# EAGLE design enc_ma710 (EAGLE 9.6.2)
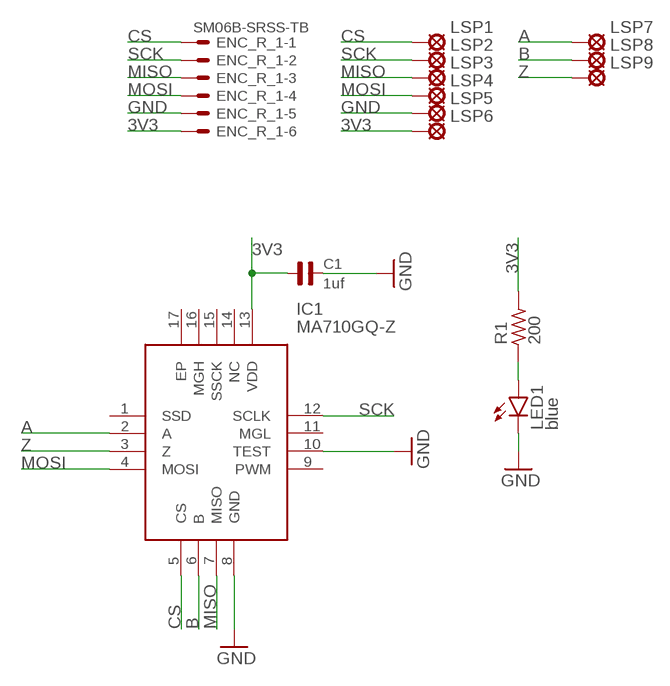
[diagram p0: schematic, sheet 1]

## Parts
C1  1uf  C0603  [0603]
ENC_R_1  SM06B-SRSS-TB  [SM06B-SRSS-TB]
IC1  MA710GQ-Z  [QFN50P300X300X100-17N]
LED1  blue  LEDSML0603  [SML0603]
LSP1  LSP10  [LSP10]
LSP2  LSP10  [LSP10]
LSP3  LSP10  [LSP10]
LSP4  LSP10  [LSP10]
LSP5  LSP10  [LSP10]
LSP6  LSP10  [LSP10]
LSP7  LSP10  [LSP10]
LSP8  LSP10  [LSP10]
LSP9  LSP10  [LSP10]
R1  200  R_0603  [R0603]

## Nets
3V3: C1.1 ENC_R_1.6 IC1.13(VDD) LSP6.MP R1.2
A: IC1.2(A) LSP7.MP
B: IC1.6(B) LSP8.MP
CS: ENC_R_1.1 IC1.5(CS) LSP1.MP
GND: C1.2 ENC_R_1.5 IC1.8(GND) IC1.10(TEST) LED1.C LSP5.MP
MISO: ENC_R_1.3 IC1.7(MISO) LSP3.MP
MOSI: ENC_R_1.4 IC1.4(MOSI) LSP4.MP
N$2: LED1.A R1.1
SCK: ENC_R_1.2 IC1.12(SCLK) LSP2.MP
Z: IC1.3(Z) LSP9.MP
Unconnected: IC1.1(SSD) IC1.9(PWM) IC1.11(MGL) IC1.14(NC) IC1.15(SSCK) IC1.16(MGH) IC1.17(EP)

## Library data of the parts
C1 = capsmd:C0603
ENC_R_1 = con-jst2:?M06B-SRSS-TB: Disconnectable Crimp style connector, 1.0mm pitch 6 contacts
IC1 = MA710GQ-Z:MA710GQ-Z: Board Mount Hall Effect / Magnetic Sensors 12-bit, digital, contactless angle sensor with ABZ incremental & PWM outputs Source: Datasheet <https://mouser.componentsearchengine.com/Datasheets/1/MA710GQ-Z.pdf>; DESCRIPTION: Board Mount Hall Effect / Magnetic Sensors 12-bit, digital, contactless angle sensor with ABZ incremental & PWM outputs; HEIGHT: 1mm; MANUFACTURER_NAME: Monolithic Power Systems (MPS); MANUFACTURER_PART_NUMBER: MA710GQ-Z; MOUSER_PART_NUMBER: 946-MA710GQ-Z; MOUSER_PRICE-STOCK: https://www.mouser.co.uk/ProductDetail/Monolithic-Power-Systems-MPS/MA710GQ-Z?qs=YCa%2FAAYMW008m2sVybM2dg%3D%3D
LED1 = led:LED: LED OSRAM: - CHIPLED LG R971, LG N971, LY N971, LG Q971, LY Q971, LO R971, LY R971 LH N974, LH R974 LS Q976, LO Q976, LY Q976 LO Q996 - Hyper CHIPLED LW Q18S LB Q993, LB Q99A, LB R99A - SideLED LS A670, LO A670, LY A670, LG A670, LP A670 LB A673, LV A673, LT A673, LW A673 LH A674 LY A675 LS A676, LA A676, LO A676, LY A676, LW A676 LS A679, LY A679, LG A679 - Hyper Micro SIDELED® LS Y876, LA Y876, LO Y876, LY Y876 LT Y87S - SmartLED LW L88C, LW L88S LB L89C, LB L89S, LG L890 LS L89K, LO L89K, LY L89K LS L896, LA L896, LO L896, LY L896 - TOPLED LS T670, LO T670, LY T670, LG T670, LP T670 LSG T670, LSP T670, LSY T670, LOP T670, LYG T670 LG T671, LOG T671, LSG T671 LB T673, LV T673, LT T673, LW T673 LH T674 LS T676, LA T676, LO T676, LY T676, LB T676, LH T676, LSB T676, LW T676 LB T67C, LV T67C, LT T67C, LS T67K, LO T67K, LY T67K, LW E67C LS E67B, LA E67B, LO E67B, LY E67B, LB E67C, LV E67C, LT E67C LW T67C LS T679, LY T679, LG T679 LS T770, LO T770, LY T770, LG T770, LP T770 LB T773, LV T773, LT T773, LW T773 LH T774 LS E675, LA E675, LY E675, LS T675 LS T776, LA T776, LO T776, LY T776, LB T776 LHGB T686 LT T68C, LB T68C - Hyper Mini TOPLED® LB M676 - Mini TOPLED Santana® LG M470 LS M47K, LO M47K, LY M47K Source: http://www.osram.convergy.de LUXEON: - LUMILED® LXK2-PW12-R00, LXK2-PW12-S00, LXK2-PW14-U00, LXK2-PW14-V00 LXK2-PM12-R00, LXK2-PM12-S00, LXK2-PM14-U00 LXK2-PE12-Q00, LXK2-PE12-R00, LXK2-PE12-S00, LXK2-PE14-T00, LXK2-PE14-U00 LXK2-PB12-K00, LXK2-PB12-L00, LXK2-PB12-M00, LXK2-PB14-N00, LXK2-PB14-P00, LXK2-PB14-Q00 LXK2-PR12-L00, LXK2-PR12-M00, LXK2-PR14-Q00, LXK2-PR14-R00 LXK2-PD12-Q00, LXK2-PD12-R00, LXK2-PD12-S00 LXK2-PH12-R00, LXK2-PH12-S00 LXK2-PL12-P00, LXK2-PL12-Q00, LXK2-PL12-R00 Source: www.luxeon.com KINGBRIGHT: KA-3528ASYC Source: www.kingbright.com
LSP1-LSP9 = solpad:LSP10: SOLDER PAD drill 1.0 mm, distributor Buerklin, 12H555
R1 = rc-master-smd:R_: RESISTOR

## Board
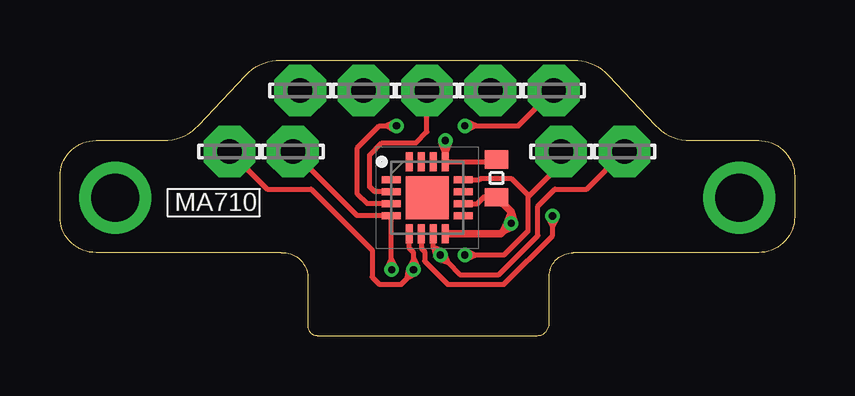
[diagram p1: board, top side]
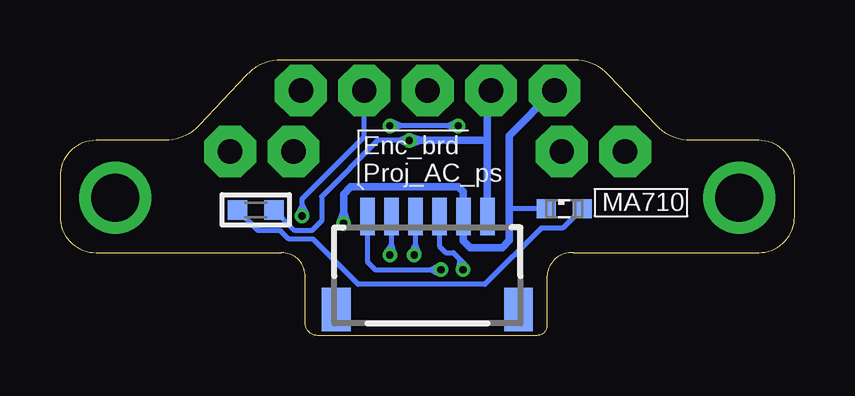
[diagram p2: board, bottom side, seen from below]

Size 30.61 x 11.48 mm. Coordinates in mm from the lower left corner, seen from the top.
Outline: 5.77,8.76 7.74,10.85 arc-47 9.2,11.48 21.38,11.48 arc-47 22.84,10.85 24.81,8.76 arc47 26.26,8.13 29.11,8.13 arc-90 30.61,6.63 30.61,4.95 arc-90 29.11,3.45 21.38,3.45 arc90 20.38,2.45 20.38,0.5 arc-90 19.88,0 10.72,0 arc-90 10.33,0.4 10.33,2.45 arc90 9.22,3.45 1.5,3.45 arc-90 0,4.95 0,6.63 arc-90 1.5,8.13 4.32,8.13 arc47 5.77,8.76
Copper layers (1*16): Top 0.035mm / dielectric 1.5mm / Bottom 0.035mm
Design rules "shuang_2layer_jlc_t1_compact": minimum track width 6mil, minimum drill 0.3mm, track to track 6mil, track to pad 6mil, pad to pad 6mil, via to via 6mil, smd to smd 6mil, copper to edge 5mil, drill to drill 6mil, minimum pad ring 6mil, minimum via ring 6mil, stop-mask expansion 4mil, vias tented up to drill 15mil, thermal gap 10mil

### Footprints (pad centres in the part's own frame; a part is rotated, then mirrored left to right if it is on the bottom)
0603 = smd 0.762 x 0.965: 1 -0.787,0; 2 0.787,0
SM06B-SRSS-TB = smd 0.6 x 1.55: 1 -2.5,2.975; 2 -1.5,2.975; 3 -0.5,2.975; 4 0.5,2.975; 5 1.5,2.975; 6 2.5,2.975 | smd 1.2 x 1.8: FIT@1 -3.8,-0.9; FIT@2 3.8,-0.9
QFN50P300X300X100-17N = smd 0.8 x 0.3: 1 -1.5,0.75; 2 -1.5,0.25; 3 -1.5,-0.25; 4 -1.5,-0.75; 9 1.5,-0.75; 10 1.5,-0.25; 11 1.5,0.25; 12 1.5,0.75 | smd 0.3 x 0.8: 5 -0.75,-1.5; 6 -0.25,-1.5; 7 0.25,-1.5; 8 0.75,-1.5; 13 0.75,1.5; 14 0.25,1.5; 15 -0.25,1.5; 16 -0.75,1.5 | smd 1.8 x 1.8: 17 0,0
SML0603 = smd 0.8 x 0.8: A 0.75,0; C -0.75,0
LSP10 = drill 1.016 pad 2.159 octagon: MP 0,0
R0603 = smd 0.8 x 0.8: 1 -0.762,0; 2 0.762,0

### Placement (x,y rotation side)
C1  18.19,6.55 270 top
ENC_R_1  15.3,1.98 0 bottom
IC1  15.3,5.74 0 top
LED1  9.6,5.28 0 bottom
LSP1  7.06,7.67 0 top
LSP2  20.88,7.67 0 top
LSP3  23.52,7.67 0 top
LSP4  9.7,7.67 0 top
LSP5  10.01,10.21 0 top
LSP6  12.65,10.21 0 top
LSP7  15.29,10.21 0 top
LSP8  17.93,10.21 0 top
LSP9  20.57,10.21 0 top
R1  22.45,5.23 0 bottom

### Tracks (layer width: path | path; a pad name or v marks a point on that pad's centre or on a via)
3V3  (via drill 0.3)
  Top 0.203: IC1.13 18.09,7.24 C1.1
  Top 0.305: IC1.13 16.05,7.68 | 16.05,7.68 v16.05,8.13 | 16.05,7.68 16.19,8.08 v16.05,8.13 | 16.05,7.68 15.91,8.08 v16.05,8.13
  Bottom 0.203: v16.05,8.13 16.5,8.13 | 16.5,8.13 17.37,8.13 19.71,5.79 19.71,4.78 20.12,4.37 20.83,4.37 R1.2 | 16.5,8.13 16.14,8.31 v16.05,8.13 | 16.5,8.13 16.14,7.95 v16.05,8.13
  Bottom 0.305: ENC_R_1.6 12.8,8.13 | 12.8,8.13 12.8,10.06 LSP6.MP | v16.05,8.13 15.6,8.13 | 15.6,8.13 12.8,8.13 | 15.6,8.13 16,7.99 v16.05,8.13 | 15.6,8.13 16,8.27 v16.05,8.13
A
  Top 0.203: IC1.2 13.11,5.99 12.9,6.2 12.9,7.52 13.41,8.03 14.83,8.03 15.29,8.48 LSP7.MP
B  (via drill 0.3)
  Top 0.203: IC1.6 15.05,3.63 15.19,3.5 15.19,3.1 16.15,2.13 18.49,2.13 20.52,4.17 20.52,4.53 | 20.52,4.53 v20.52,4.98 | 20.52,4.53 20.7,4.89 v20.52,4.98 | 20.52,4.53 20.34,4.89 v20.52,4.98
  Bottom 0.203: v20.52,4.98 20.52,5.43 | 20.52,5.43 20.52,5.69 17.93,8.28 LSP8.MP | 20.52,5.43 20.34,5.07 v20.52,4.98 | 20.52,5.43 20.7,5.07 v20.52,4.98
CS  (via drill 0.3)
  Top 0.203: v14.73,2.74 14.73,3.19 | 14.73,3.19 14.73,3.45 14.55,3.63 IC1.5 | LSP1.MP 8.64,6.1 10.46,6.1 13,3.56 13,2.44 13.31,2.13 14.22,2.13 14.47,2.38 | 14.47,2.38 14.73,2.64 v14.73,2.74 | 14.73,3.19 14.55,2.83 v14.73,2.74 | 14.73,3.19 14.91,2.83 v14.73,2.74 | 14.47,2.38 14.82,2.57 v14.73,2.74 | 14.47,2.38 14.53,2.78 v14.73,2.74
  Bottom 0.203: ENC_R_1.1 17.8,3.07 17.47,2.74 15.18,2.74 | 15.18,2.74 v14.73,2.74 | 15.18,2.74 14.82,2.92 v14.73,2.74 | 15.18,2.74 14.82,2.56 v14.73,2.74
GND  (via drill 0.3)
  Top 0.203: IC1.10 17.38,5.49 17.65,5.77 C1.2
  Top 0.305: C1.2 18.8,5.16 18.8,5.12 | 18.8,5.12 v18.8,4.67 | IC1.8 18.37,4.24 18.48,4.36 | 18.48,4.36 v18.8,4.67 | 18.8,5.12 18.65,4.72 v18.8,4.67 | 18.8,5.12 18.94,4.72 v18.8,4.67 | 18.48,4.36 18.86,4.54 v18.8,4.67 | 18.48,4.36 18.66,4.74 v18.8,4.67
  Bottom 0.203: LED1.C 11.89,5.28
  Bottom 0.305: LSP5.MP 11.89,8.33 11.89,5.28 11.89,3.96 12.19,3.66 13.51,3.66 13.8,3.95 ENC_R_1.5 13.8,5.98 14.02,6.2 18.49,6.2 18.8,5.89 18.8,5.12 | 18.8,5.12 v18.8,4.67 | 18.8,5.12 18.65,4.72 v18.8,4.67 | 18.8,5.12 18.94,4.72 v18.8,4.67
MISO  (via drill 0.3)
  Top 0.203: v15.85,3.35 15.55,3.65 15.55,3.69 | 15.55,3.69 IC1.7 | v15.85,3.35 16.17,3.03 | 16.17,3.03 16.66,2.54 18.29,2.54 19.91,4.17 19.91,5.39 20.62,6.1 21.95,6.1 LSP3.MP | 15.55,3.69 15.65,3.3 v15.85,3.35 | 15.55,3.69 15.93,3.54 v15.85,3.35 | 16.17,3.03 16.04,3.42 v15.85,3.35 | 16.17,3.03 15.79,3.16 v15.85,3.35
  Bottom 0.203: ENC_R_1.3 15.8,3.8 | 15.8,3.8 15.8,3.4 v15.85,3.35 | 15.8,3.8 15.66,3.42 v15.85,3.35 | 15.8,3.8 16.02,3.46 v15.85,3.35
MOSI  (via drill 0.3)
  Top 0.203: v13.82,2.74 13.8,2.76 13.8,3.19 | 13.8,3.19 IC1.4 12.38,4.99 LSP4.MP | 13.8,3.19 13.64,2.83 v13.82,2.74 | 13.8,3.19 13.99,2.84 v13.82,2.74
  Bottom 0.203: ENC_R_1.4 14.8,3.73 14.53,3.45 14.22,3.45 13.94,3.18 | 13.94,3.18 13.82,3.05 v13.82,2.74 | 13.94,3.18 13.67,2.88 v13.82,2.74 | 13.94,3.18 14.01,2.78 v13.82,2.74
N$1  (via drill 2)
  other vias: 2.3,5.74
N$2
  Bottom 0.203: LED1.A 9.66,4.47 10.57,4.47 12.9,2.13 18.19,2.13 20.07,4.01 21.08,4.01 21.43,4.37 22.35,4.37 R1.1
N$3  (via drill 2)
  other vias: 28.3,5.74
SCK  (via drill 0.3)
  Top 0.203: IC1.12 17.47,6.49 17.53,6.55 18.8,6.55 19.51,5.84 19.51,5.79 | 19.51,5.79 19.51,4.37 18.49,3.35 17.32,3.35 | 17.32,3.35 v16.87,3.35 | 19.51,5.79 20.88,7.16 LSP2.MP | 17.32,3.35 16.95,3.53 v16.87,3.35 | 17.32,3.35 16.95,3.17 v16.87,3.35
  Bottom 0.203: ENC_R_1.2 16.8,3.8 | 16.8,3.8 16.8,3.41 v16.87,3.35 | 16.8,3.8 16.68,3.42 v16.87,3.35 | 16.8,3.8 17.03,3.47 v16.87,3.35
Z  (via drill 0.3)
  Top 0.203: IC1.3 12.79,5.49 12.39,5.89 12.39,7.82 13.31,8.74 13.57,8.74 | 13.57,8.74 v14.02,8.74 | v16.87,8.74 17.32,8.74 | 17.32,8.74 19.1,8.74 LSP9.MP | 13.57,8.74 13.93,8.56 v14.02,8.74 | 13.57,8.74 13.93,8.92 v14.02,8.74 | 17.32,8.74 16.95,8.92 v16.87,8.74 | 17.32,8.74 16.95,8.56 v16.87,8.74
  Bottom 0.203: v14.02,8.74 14.47,8.74 | 14.47,8.74 16.42,8.74 | 16.42,8.74 v16.87,8.74 | 14.47,8.74 14.11,8.92 v14.02,8.74 | 14.47,8.74 14.11,8.56 v14.02,8.74 | 16.42,8.74 16.78,8.56 v16.87,8.74 | 16.42,8.74 16.78,8.92 v16.87,8.74

### Text on the board
tPlace: MA710
bPlace: Enc_brd / Proj_AC_ps | MA710